# Altium schematic sheet NFC_Access_CPU2_R00.SchDoc: NFC Access Board
size A4; Author: Hernan M. Travado; CompanyName: UTN FRBA; Revision: 1.0; SheetNumber: 6; SheetTotal: 7
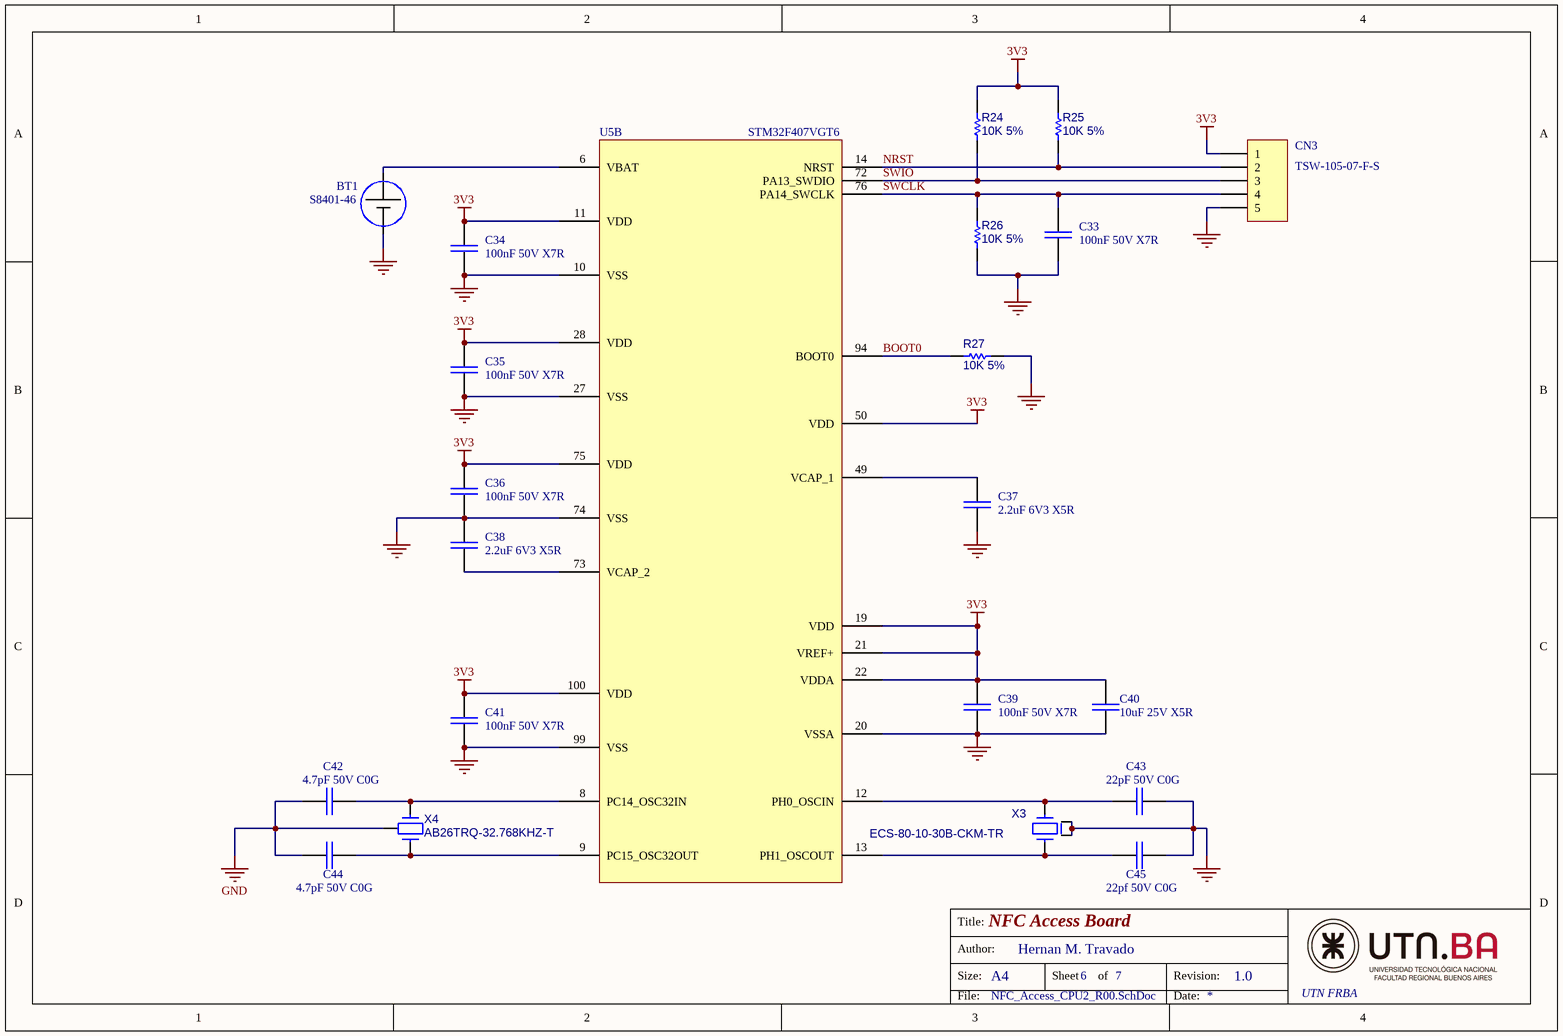
[diagram p0: NFC_Access_CPU2_R00.SchDoc]

## Parts
BT1  S8401-46  [S8401-46]
C33  100nF 50V X7R  [C_0603]
C34  100nF 50V X7R  [C_0603]
C35  100nF 50V X7R  [C_0603]
C36  100nF 50V X7R  [C_0603]
C37  2.2uF 6V3 X5R  [C_0603]
C38  2.2uF 6V3 X5R  [C_0603]
C39  100nF 50V X7R  [C_0603]
C40  10uF 25V X5R  [C_0603]
C41  100nF 50V X7R  [C_0603]
C42  4.7pF 50V C0G  [C_0603]
C43  22pF 50V C0G  [C_0603]
C44  4.7pF 50V C0G  [C_0603]
C45  22pf 50V C0G  [C_0603]
CN3  TSW-105-07-F-S  [Header_M_1x5_0.1"]
R24  10K 5%  [R_0603]
R25  10K 5%  [R_0603]
R26  10K 5%  [R_0603]
R27  10K 5%  [R_0603]
U5  STM32F407VGT6  [LQFP100]  (part B of 2)
X3  ECS-80-10-30B-CKM-TR  [ABM3C]
X4  AB26TRQ-32.768KHZ-T  [AB26TQF]

## Nets
3V3: C34.1 C35.1 C36.1 C39.2 C40.1 C41.1 CN3.1 R24.1 R25.1 U5.11(VDD) U5.19(VDD) U5.21(VREF+) U5.22(VDDA) U5.28(VDD) U5.50(VDD) U5.75(VDD) U5.100(VDD)
GND: BT1.1(V-) C33.2 C34.2 C35.2 C36.2 C37.2 C38.2 C39.1 C40.2 C41.2 C42.2 C43.2 C44.2 C45.2 CN3.5 R26.2 R27.1 U5.10(VSS) U5.20(VSSA) U5.27(VSS) U5.74(VSS) U5.99(VSS) X3.2 X3.4 X4.3
BOOT0: R27.2 U5.94(BOOT0)
NRST: CN3.2 R25.2 U5.14(NRST)
SWCLK: C33.1 CN3.4 R26.1 U5.76(PA14_SWCLK)
SWIO: CN3.3 R24.2 U5.72(PA13_SWDIO)
NetBT1_2: BT1.2(V+) U5.6(VBAT)
NetC37_1: C37.1 U5.49(VCAP_1)
NetC38_1: C38.1 U5.73(VCAP_2)
NetC42_1: C42.1 U5.8(PC14_OSC32IN) X4.2
NetC43_1: C43.1 U5.12(PH0_OSCIN) X3.1
NetC44_1: C44.1 U5.9(PC15_OSC32OUT) X4.1
NetC45_1: C45.1 U5.13(PH1_OSCOUT) X3.3

## Notes on the sheet
- Title:
- Size:
- Author:
- A4
- Sheet
- of
- Revision:
- File:
- Date:

## Library data of the parts
BT1 = CR2032: BATT HLDR COIN 20MM 1 CEL PC PIN / 952-1743-2-ND
C33-C36 C39 C41 = Ceramic capacitor: Ceramic Capacitor / 1276-1018-2-ND
C37 C38 = Ceramic capacitor: Ceramic Capacitor / 1276-1183-2-ND
C40 = Ceramic capacitor: Ceramic Capacitor / MNF:GRM31CR61E106KA12L / DGK:1276-1869-2-ND
C42 C44 = Ceramic capacitor: Ceramic Capacitor / 1276-1792-2-ND
C43 C45 = Ceramic capacitor: Ceramic Capacitor / 1276-2228-2-ND
CN3 = CONN_05P: CONN HEADER VERT 5POS 2.54MM / SAM10336-ND
R24-R27 = Res1: Resistor / CR0603-JW-103ELFTR-ND
U5 = STM32F407: Cortex M4 32bit CPU / 497-11605-ND
X3 = CRYSTAL_4P: Crystal 4 Vias + GND 8 MHz / 50-ECS-80-10-30B-CKM-TR-ND
X4 = CRYSTAL 3P: Crystal 2 Vias + GND 32.768 kHz / 535-12051-2-ND